# EAGLE design ftdi (EAGLE 6.5.0)
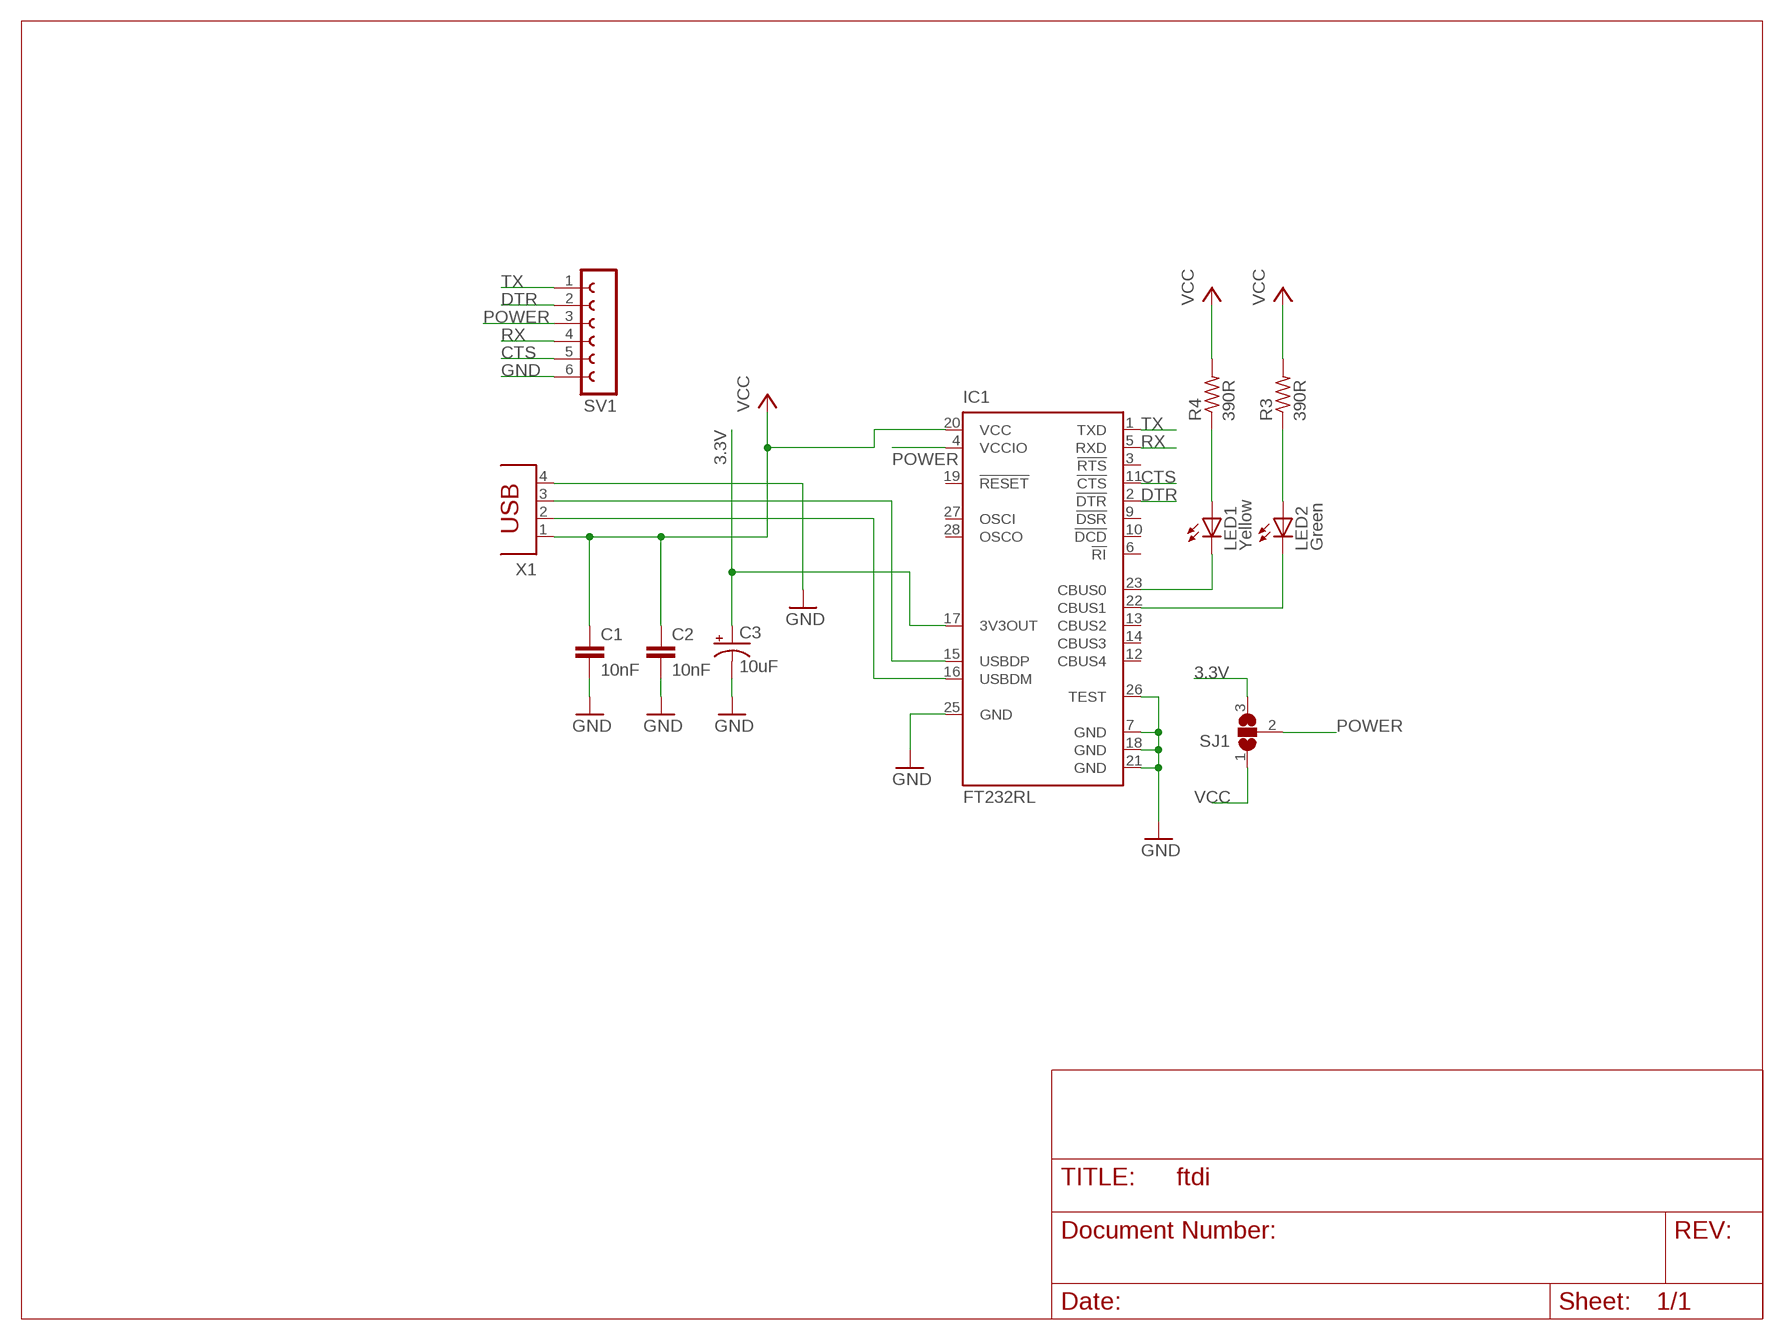
[diagram p0: schematic, sheet 1]

## Parts
C1  10nF  C-EUC0805  [C0805]
C2  10nF  C-EUC0805  [C0805]
C3  10uF  CPOL-USE2.5-6  [E2,5-6]
IC1  FT232RL  [SSOP28]
LED1  Yellow  LED5MM  [LED5MM]
LED2  Green  LED5MM  [LED5MM]
R3  390R  R-US_R0805  [R0805]
R4  390R  R-US_R0805  [R0805]
SJ1  SJ2W  [SJ_2]
SV1  FE06-1  [FE06]
X1  PN87520  [PN87520]

## Nets
3.3V: C3.+ IC1.17(3V3OUT) SJ1.3
CTS: IC1.11(!CTS) SV1.5
DTR: IC1.2(!DTR) SV1.2
GND: C1.2 C2.2 C3.- IC1.7(GND) IC1.18(GND) IC1.21(GND) IC1.25(GND) IC1.26(TEST) SV1.6 X1.4
N$1: IC1.23(CBUS0) LED1.K(C)
N$2: IC1.22(CBUS1) LED2.K(C)
N$3: LED2.A R3.1
N$4: LED1.A R4.1
N$7: IC1.16(USBDM) X1.2
N$8: IC1.15(USBDP) X1.3
POWER: IC1.4(VCCIO) SJ1.2 SV1.3
RX: IC1.5(RXD) SV1.4
TX: IC1.1(TXD) SV1.1
VCC: C1.1 C2.1 IC1.20(VCC) R3.2 R4.2 SJ1.1 X1.1
Unconnected: IC1.3(!RTS) IC1.6(!RI) IC1.9(!DSR) IC1.10(!DCD) IC1.12(CBUS4) IC1.13(CBUS2) IC1.14(CBUS3) IC1.19(!RESET) IC1.27(OSCI) IC1.28(OSCO)

## Library data of the parts
C1 C2 = rcl:C-EU: CAPACITOR, European symbol
C3 = rcl:CPOL-US: POLARIZED CAPACITOR, American symbol
IC1 = ftdichip:FT232R: Source: http://www.ftdichip.com/Documents/DataSheets/DS_FT232R_v104.pdf; MPN: FT232RL; OC_FARNELL: 1146032; OC_NEWARK: 91K9918
LED1 LED2 = led:LED: LED OSRAM: - CHIPLED LG R971, LG N971, LY N971, LG Q971, LY Q971, LO R971, LY R971 LH N974, LH R974 LS Q976, LO Q976, LY Q976 LO Q996 - Hyper CHIPLED LW Q18S LB Q993, LB Q99A, LB R99A - SideLED LS A670, LO A670, LY A670, LG A670, LP A670 LB A673, LV A673, LT A673, LW A673 LH A674 LY A675 LS A676, LA A676, LO A676, LY A676, LW A676 LS A679, LY A679, LG A679 - Hyper Micro SIDELED® LS Y876, LA Y876, LO Y876, LY Y876 LT Y87S - SmartLED LW L88C, LW L88S LB L89C, LB L89S, LG L890 LS L89K, LO L89K, LY L89K LS L896, LA L896, LO L896, LY L896 - TOPLED LS T670, LO T670, LY T670, LG T670, LP T670 LSG T670, LSP T670, LSY T670, LOP T670, LYG T670 LG T671, LOG T671, LSG T671 LB T673, LV T673, LT T673, LW T673 LH T674 LS T676, LA T676, LO T676, LY T676, LB T676, LH T676, LSB T676, LW T676 LB T67C, LV T67C, LT T67C, LS T67K, LO T67K, LY T67K, LW E67C LS E67B, LA E67B, LO E67B, LY E67B, LB E67C, LV E67C, LT E67C LW T67C LS T679, LY T679, LG T679 LS T770, LO T770, LY T770, LG T770, LP T770 LB T773, LV T773, LT T773, LW T773 LH T774 LS E675, LA E675, LY E675, LS T675 LS T776, LA T776, LO T776, LY T776, LB T776 LHGB T686 LT T68C, LB T68C - Hyper Mini TOPLED® LB M676 - Mini TOPLED Santana® LG M470 LS M47K, LO M47K, LY M47K Source: http://www.osram.convergy.de LUXEON: - LUMILED® LXK2-PW12-R00, LXK2-PW12-S00, LXK2-PW14-U00, LXK2-PW14-V00 LXK2-PM12-R00, LXK2-PM12-S00, LXK2-PM14-U00 LXK2-PE12-Q00, LXK2-PE12-R00, LXK2-PE12-S00, LXK2-PE14-T00, LXK2-PE14-U00 LXK2-PB12-K00, LXK2-PB12-L00, LXK2-PB12-M00, LXK2-PB14-N00, LXK2-PB14-P00, LXK2-PB14-Q00 LXK2-PR12-L00, LXK2-PR12-M00, LXK2-PR14-Q00, LXK2-PR14-R00 LXK2-PD12-Q00, LXK2-PD12-R00, LXK2-PD12-S00 LXK2-PH12-R00, LXK2-PH12-S00 LXK2-PL12-P00, LXK2-PL12-Q00, LXK2-PL12-R00 Source: www.luxeon.com KINGBRIGHT: KA-3528ASYC Source: www.kingbright.com
R3 R4 = rcl:R-US_: RESISTOR, American symbol
SJ1 = jumper:SJ2W: SMD solder JUMPER
SV1 = con-lsta:FE06-1: FEMALE HEADER; OC_FARNELL: unknown; OC_NEWARK: unknown
X1 = con-berg:PN87520: BERG USB connector; OC_FARNELL: unknown; OC_NEWARK: unknown

## Board
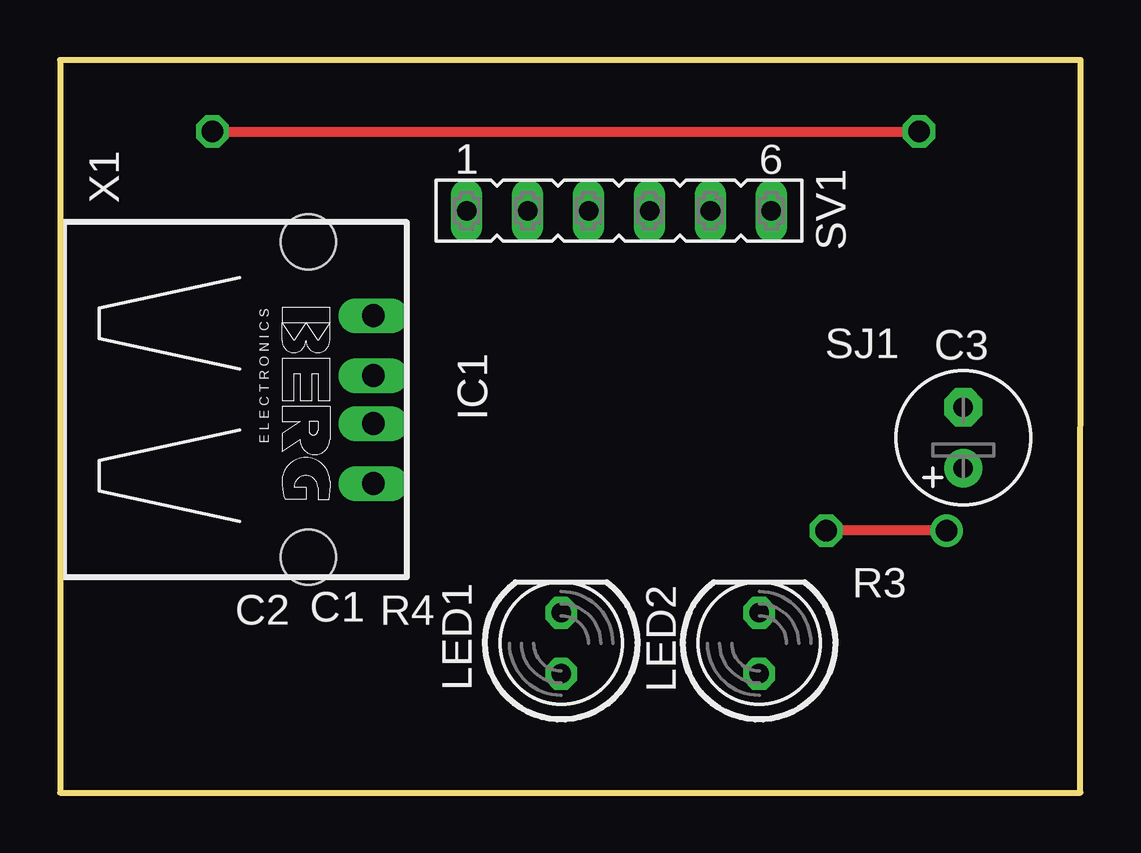
[diagram p1: board, top side]
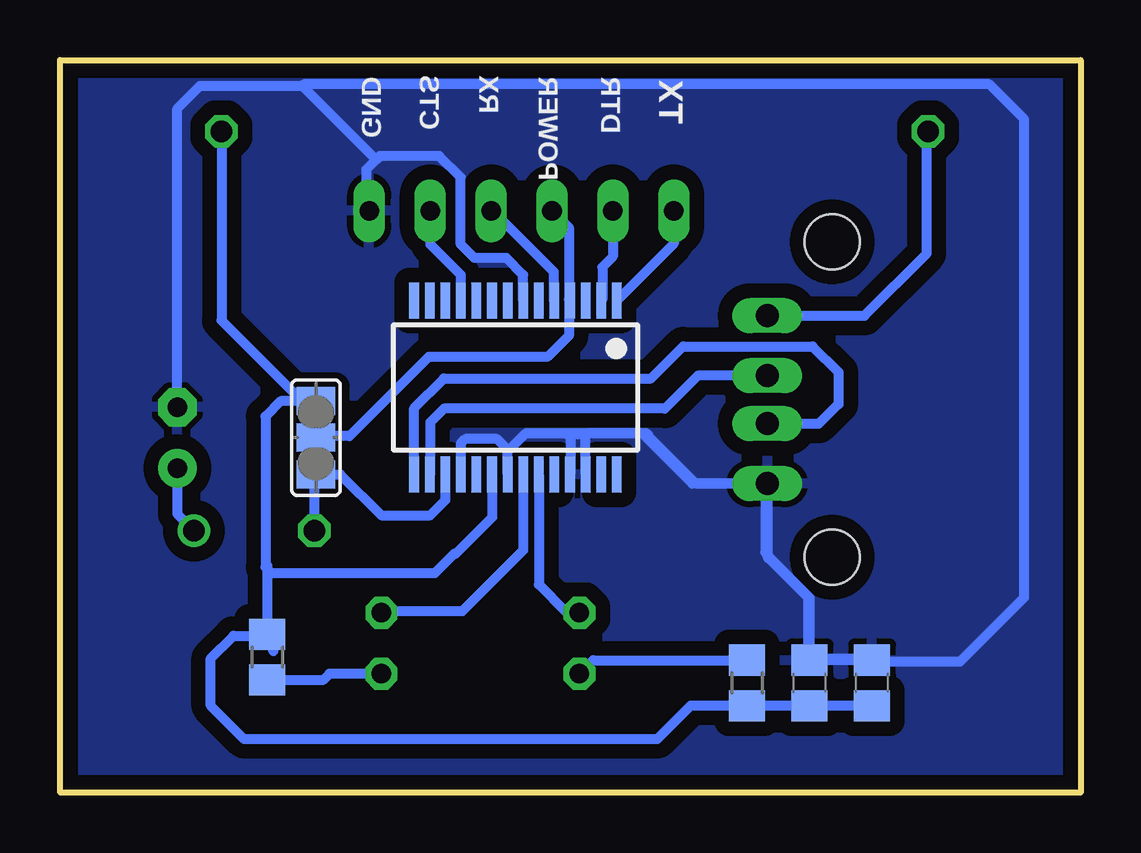
[diagram p2: board, bottom side, seen from below]

Size 42.55 x 30.54 mm. Coordinates in mm from the lower left corner, seen from the top.
Outline: 0,0 42.53,0 42.55,30.54 0,30.54 0,0
Copper layers (1*16): Top 0.035mm / dielectric 1.5mm / Bottom 0.035mm
Design rules "default *": minimum track width 10mil, minimum drill 24mil, track to track 8mil, track to pad 8mil, pad to pad 8mil, via to via 8mil, smd to smd 8mil, copper to edge 12mil, drill to drill 8mil, minimum pad ring 10mil, minimum via ring 8mil, stop-mask expansion 4mil, vias tented up to drill 0mil, thermal gap 10mil

### Footprints (pad centres in the part's own frame; a part is rotated, then mirrored left to right if it is on the bottom)
C0805 = smd 1.3 x 1.5: 1 -0.95,0; 2 0.95,0
E2,5-6 = drill 0.813 pad 1.6: + -1.27,0 | drill 0.813 pad 1.6 octagon: - 1.27,0
SSOP28 = smd 0.4 x 1.5: 1 -4.225,-3.625; 2 -3.575,-3.625; 3 -2.925,-3.625; 4 -2.275,-3.625; 5 -1.625,-3.625; 6 -0.975,-3.625; 7 -0.325,-3.625; 8 0.325,-3.625; 9 0.975,-3.625; 10 1.625,-3.625; 11 2.275,-3.625; 12 2.925,-3.625; 13 3.575,-3.625; 14 4.225,-3.625; 15 4.225,3.625; 16 3.575,3.625; 17 2.925,3.625; 18 2.275,3.625; 19 1.625,3.625; 20 0.975,3.625; 21 0.325,3.625; 22 -0.325,3.625; 23 -0.975,3.625; 24 -1.625,3.625; 25 -2.275,3.625; 26 -2.925,3.625; 27 -3.575,3.625; 28 -4.225,3.625
LED5MM = drill 0.813 octagon: A -1.27,0; K 1.27,0
R0805 = smd 1.3 x 1.5: 1 -0.95,0; 2 0.95,0
SJ_2 = smd 1.168 x 1.6: 1 -1.524,0; 2 0,0; 3 1.524,0
FE06 = drill 0.813 long: 1 -6.35,0; 2 -3.81,0; 3 -1.27,0; 4 1.27,0; 5 3.81,0; 6 6.35,0
PN87520 = drill 0.95 long: 1 -3.5,2.71; 2 -1,2.71; 3 1,2.71; 4 3.5,2.71 | hole 2.3: -6.57,0; 6.57,0

### Placement (x,y rotation side)
C1  11.3,4.57 90 bottom
C2  8.7,4.57 90 bottom
C3  37.66,14.8 90 top
IC1  23.56,16.89 180 bottom
LED1  20.89,6.22 90 top
LED2  29.15,6.22 90 top
R3  33.91,5.65 90 bottom
R4  13.91,4.57 270 bottom
SJ1  31.88,14.8 270 bottom
SV1  23.3,24.26 0 top
X1  10.35,16.38 270 top

### Tracks (layer width: path | path; a pad name or v marks a point on that pad's centre or on a via)
3.3V  (via drill 0.9)
  Top 0.406: v36.96,10.92 v31.94,10.92
  Bottom 0.406: IC1.17 26.48,12.19 27.11,11.56 29.15,11.56 30.86,13.27 SJ1.3 31.94,13.21 v31.94,10.92 | C3.+ 37.66,11.62 v36.96,10.92
CTS
  Bottom 0.406: SV1.5 27.11,22.86 25.84,21.59 25.84,20.53 IC1.11
DTR
  Bottom 0.406: SV1.2 19.49,22.35 19.94,21.91 19.94,20.56 IC1.2
GND
  Bottom 0.406: 21.46,14.99 23.11,14.99 23.88,14.22 IC1.21 23.88,14.29 24.32,14.73 25.65,14.73 25.84,14.54 25.84,13.28 IC1.18 | 21.46,14.99 21.27,14.8 | 21.27,14.8 IC1.25 | IC1.26 20.63,14.86 20.57,14.92 | 20.57,14.92 21.14,14.92 21.27,14.8 | IC1.7 23.23,21.58 23.94,22.29 25.27,22.29 25.84,22.86 25.84,25.65 26.73,26.54 29.21,26.54 29.37,26.38 | 29.37,26.38 29.78,25.97 29.78,24.38 SV1.6 | 20.57,14.92 20.51,14.99 18.29,14.99 16.18,12.88 X1.4 13.06,9.89 11.3,8.13 C1.2 C2.2 | C3.- 37.66,28.51 36.7,29.46 32.45,29.46 | 32.45,29.46 29.37,26.38 | 21.46,14.99 18.16,14.99 | 18.16,14.99 18.1,14.99 18.03,14.92 18.1,14.92 | 18.1,14.92 18.16,14.99 | 18.1,14.92 16.07,12.89 13.21,12.89 13.14,12.95 13.14,10.03 13.02,9.91 13.02,9.78 11.37,8.13 11.37,5.59 8.7,5.59 8.57,5.46 5.02,5.46 2.35,8.13 2.35,28.07 3.81,29.53 32.38,29.53 32.45,29.46
  pour Bottom (isolate 0.61): 0.13,30.73 42.61,30.67 42.48,-0.06 0,0
N$1
  Bottom 0.406: IC1.23 22.58,8.68 21.46,7.56 20.95,7.56 LED1.K
N$2
  Bottom 0.406: IC1.22 23.23,10.1 25.78,7.56 29.08,7.56 LED2.K
N$3
  Bottom 0.406: LED2.A 31.3,4.95 31.56,4.7 R3.1
N$4
  Bottom 0.406: LED1.A 20.32,5.52 R4.1
N$7
  Bottom 0.406: X1.2 15.95,17.38 17.34,16 26.54,16 27.11,15.43 27.11,13.29 IC1.16
N$8
  Bottom 0.406: IC1.15 27.78,16.03 26.54,17.27 17.91,17.27 16.57,18.61 11.18,18.61 10.1,17.53 10.1,16.19 10.92,15.37 13.04,15.37 X1.3
POWER
  Bottom 0.406: 21.34,20.57 21.34,23.56 SV1.3 | 21.34,20.57 IC1.4 | 21.34,20.57 21.34,19.05 22.23,18.16 27.18,18.16 30.48,14.86 31.81,14.86 SJ1.2
RX
  Bottom 0.406: SV1.4 24.51,24.26 21.97,21.72 21.97,20.55 IC1.5
TX
  Bottom 0.406: SV1.1 16.95,22.89 IC1.1
VCC  (via drill 0.9)
  Top 0.406: v6.35,27.56 v35.81,27.56
  Bottom 0.406: C2.1 C1.1 R4.2 16.25,3.62 17.65,2.22 34.86,2.22 36.26,3.62 36.26,5.59 35.31,6.54 33.97,6.54 R3.2 | IC1.20 24.53,11.47 26.04,9.97 26.1,9.97 26.92,9.14 33.72,9.14 33.91,9.34 | 33.66,5.9 R3.2 | 33.91,9.46 33.91,9.34 | 33.91,9.34 R3.2 | 8.51,3.43 C2.1 | SJ1.1 32.45,16.32 | 32.45,16.32 33.34,16.32 33.97,15.68 33.97,9.4 33.91,9.34 | 8.63,3.56 C2.1 | X1.1 9.01,19.88 6.41,22.48 6.41,27.5 v6.35,27.56 | v35.81,27.56 35.81,19.68 32.45,16.32

### Text on the board
bNames: TX | DTR | POWER | RX | CTS | GND